# EAGLE design 9x Connection Board B v0.3 (EAGLE 6.5.0)
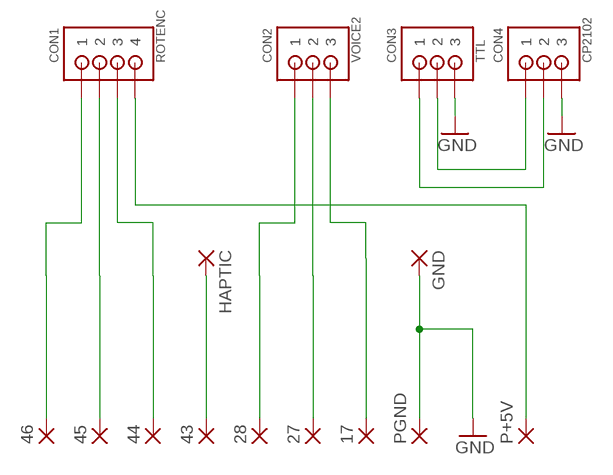
[diagram p0: schematic, sheet 1]

## Parts
17  WIREPADSMD1,27-254  [SMD1,27-2,54]
27  WIREPADSMD1,27-254  [SMD1,27-2,54]
28  WIREPADSMD1,27-254  [SMD1,27-2,54]
43  WIREPADSMD1,27-254  [SMD1,27-2,54]
44  WIREPADSMD1,27-254  [SMD1,27-2,54]
45  WIREPADSMD1,27-254  [SMD1,27-2,54]
46  WIREPADSMD1,27-254  [SMD1,27-2,54]
CON1  ROTENC  B4B-ZR  [B4B-ZR]
CON2  VOICE2  B3B-ZR  [B3B-ZR]
CON3  TTL  B3B-ZR  [B3B-ZR]
CON4  CP2102  B3B-ZR  [B3B-ZR]
GND  WIREPADSMD1,27-254  [SMD1,27-2,54]
HAPTIC  WIREPADSMD1,27-254  [SMD1,27-2,54]
P+5V  WIREPADSMD1,27-254  [SMD1,27-2,54]
PGND  WIREPADSMD1,27-254  [SMD1,27-2,54]

## Nets
GND: CON3.3 CON4.3 GND.1(P) PGND.1(P)
N$1: CON3.1 CON4.2
N$2: CON3.2 CON4.1
N$5: 43.1(P) HAPTIC.1(P)
N$16: CON1.4 P+5V.1(P)
PA5: 46.1(P) CON1.1
PA6: 45.1(P) CON1.2
PA7: 44.1(P) CON1.3
PB7: 17.1(P) CON2.3
PD2: 27.1(P) CON2.2
PD3: 28.1(P) CON2.1

## Library data of the parts
17 27 28 43-46 GND HAPTIC P+5V PGND = wirepad:WIREPAD: Wire PAD connect wire on PCB
CON1 = jst:B4B-ZR: JST-ZH Connector 4 pol, 1.5mm pitch Package: B4B-ZR Source: http://www.jst-mfg.com/product/pdf/eng/eZH.pdf
CON2-CON4 = jdc:B3B-ZR: JST-ZH Connector 3 pol, 1.5mm pitch Package: B3B-ZR Source: http://www.jst-mfg.com/product/pdf/eng/eZH.pdf

## Board
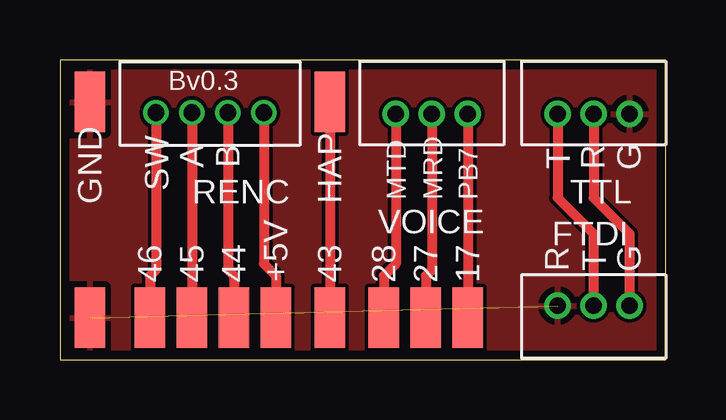
[diagram p1: board, top side]

Size 25.25 x 12.5 mm. Coordinates in mm from the lower left corner, seen from the top.
Outline: 0,0 25.25,0 25.25,12.5 0,12.5 0,0
Copper layers (1*16): Top 0.0356mm / dielectric 1.5011mm / Bottom 0.0356mm
Design rules "LaenPCBOrder *": minimum track width 6mil, minimum drill 13mil, track to track 6mil, track to pad 6mil, pad to pad 6mil, via to via 6mil, smd to smd 6mil, copper to edge 15mil, drill to drill 6mil, minimum pad ring 7mil, minimum via ring 7mil, stop-mask expansion 4mil, vias tented up to drill 24mil, thermal gap 10mil

### Footprints (pad centres in the part's own frame; a part is rotated, then mirrored left to right if it is on the bottom)
SMD1,27-2,54 = smd 1.27 x 2.54: 1 0,0
B4B-ZR = drill 0.7: 1 6,-1.3; 2 4.5,-1.3; 3 3,-1.3; 4 1.5,-1.3
B3B-ZR = drill 0.7 pad 1.1: 1 1.5,0; 2 0,0; 3 -1.5,0

### Placement (x,y rotation side)
17  17,1.75 0 top
27  15.25,1.75 0 top
28  13.5,1.75 0 top
43  11.25,1.75 0 top
44  7.25,1.75 0 top
45  5.5,1.75 0 top
46  3.75,1.75 0 top
CON1  10,9 180 top
CON2  15.5,10.25 180 top
CON3  22.25,10.25 180 top
CON4  22.25,2.25 0 top
GND  1.25,10.75 0 top
HAPTIC  11.25,10.75 0 top
P+5V  9,1.75 0 top
PGND  1.25,1.75 0 top

### Tracks (layer width: path | path; a pad name or v marks a point on that pad's centre or on a via)
GND  (1 unrouted)
  pour Top: -0.5,-0.5 25.75,-0.5 25.75,13 -0.5,13
N$1
  Top 0.406: CON3.1 20.75,6.75 21.5,6 22.25,5.25 CON4.2
N$2
  Top 0.406: CON3.2 22.25,6.75 22.75,6.25 23.75,5.25 CON4.1
N$5
  Top 0.406: HAPTIC.1 43.1
N$16
  Top 0.406: CON1.4 8.5,4 9,3.5 P+5V.1
PA5
  Top 0.406: CON1.1 4,3.75 3.75,3.5 46.1
PA6
  Top 0.406: CON1.2 45.1
PA7
  Top 0.406: CON1.3 7,3.75 7.25,3.5 44.1
PB7
  Top 0.406: CON2.3 17.1
PD2
  Top 0.406: CON2.2 15.5,3.75 15.25,3.5 27.1
PD3
  Top 0.406: CON2.1 14,4 13.5,3.5 28.1

### Text on the board
tNames: Bv0.3 | A | B | T | R | G | SW | MTD | MRD | PB7 | RENC | HAP | TTL | VOICE | FTDI | R | T | G | +5V